# EAGLE design Adafruit HUZZAH ESP8266 Basic Breakout (EAGLE 8.6.0)
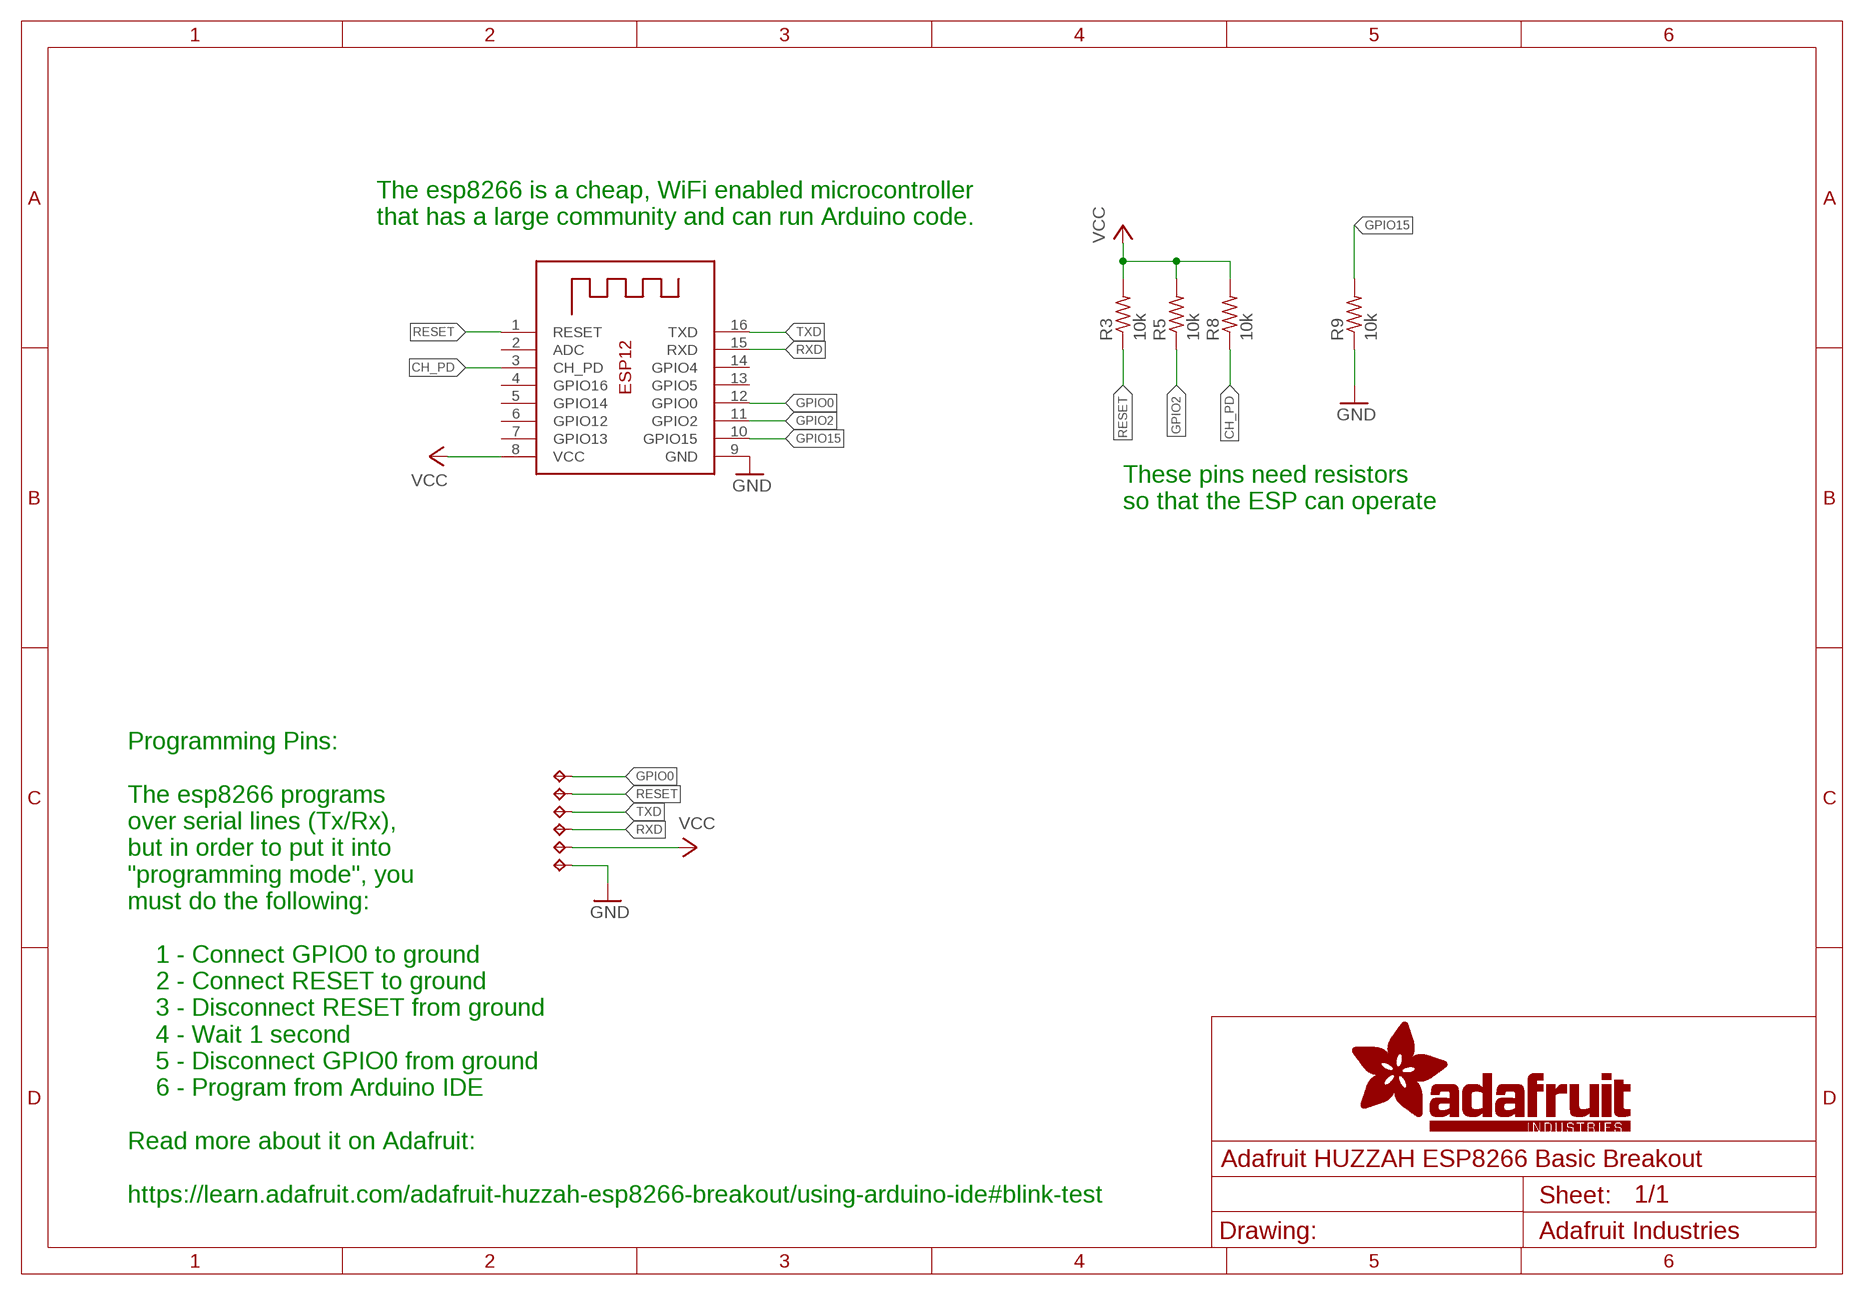
[diagram p0: schematic, sheet 1]

## Parts
GND  TPTP20R  [TP20R]
GPIO0  TPTP20R  [TP20R]
R3  10k  R-US_R0603  [R0603]
R5  10k  R-US_R0603  [R0603]
R8  10k  R-US_R0603  [R0603]
R9  10k  R-US_R0603  [R0603]
RESET  TPTP20R  [TP20R]
RX  TPTP20R  [TP20R]
TX  TPTP20R  [TP20R]
VCC  TPTP20R  [TP20R]
X1  ESP-12  [ESP-12]

## Nets
CH_PD: R8.1 X1.3(CH_PD)
GND: GND.TP R9.1 X1.9(GND)
GPIO0: GPIO0.TP X1.12(GPIO0)
GPIO2: R5.1 X1.11(GPIO2)
GPIO15: R9.2 X1.10(GPIO15)
RESET: R3.1 RESET.TP X1.1(RESET)
RXD: RX.TP X1.15(RXD)
TXD: TX.TP X1.16(TXD)
VCC: R3.2 R5.2 R8.2 VCC.TP X1.8(VCC)
Unconnected: X1.2(ADC) X1.4(GPIO16) X1.5(GPIO14) X1.6(GPIO12) X1.7(GPIO13) X1.13(GPIO5) X1.14(GPIO4)

## Notes on the sheet
- The esp8266 is a cheap, WiFi enabled microcontroller
  that has a large community and can run Arduino code.
- These pins need resistors
  so that the ESP can operate
- Programming Pins:
  
  The esp8266 programs
  over serial lines (Tx/Rx),
  but in order to put it into
  "programming mode", you
  must do the following:
  
      1 - Connect GPIO0 to ground
      2 - Connect RESET to ground
      3 - Disconnect RESET from ground
      4 - Wait 1 second
      5 - Disconnect GPIO0 from ground
      6 - Program from Arduino IDE
  
  Read more about it on Adafruit:
  
  https://learn.adafruit.com/adafruit-huzzah-esp8266-breakout/using-arduino-ide#blink-test

## Library data of the parts
GND GPIO0 RESET RX TX VCC = testpad:TP: Test pad
R3 R5 R8 R9 = rcl:R-US_: RESISTOR, American symbol; SPICEPREFIX: R
X1 = microbuilder:ESP-12

## Board
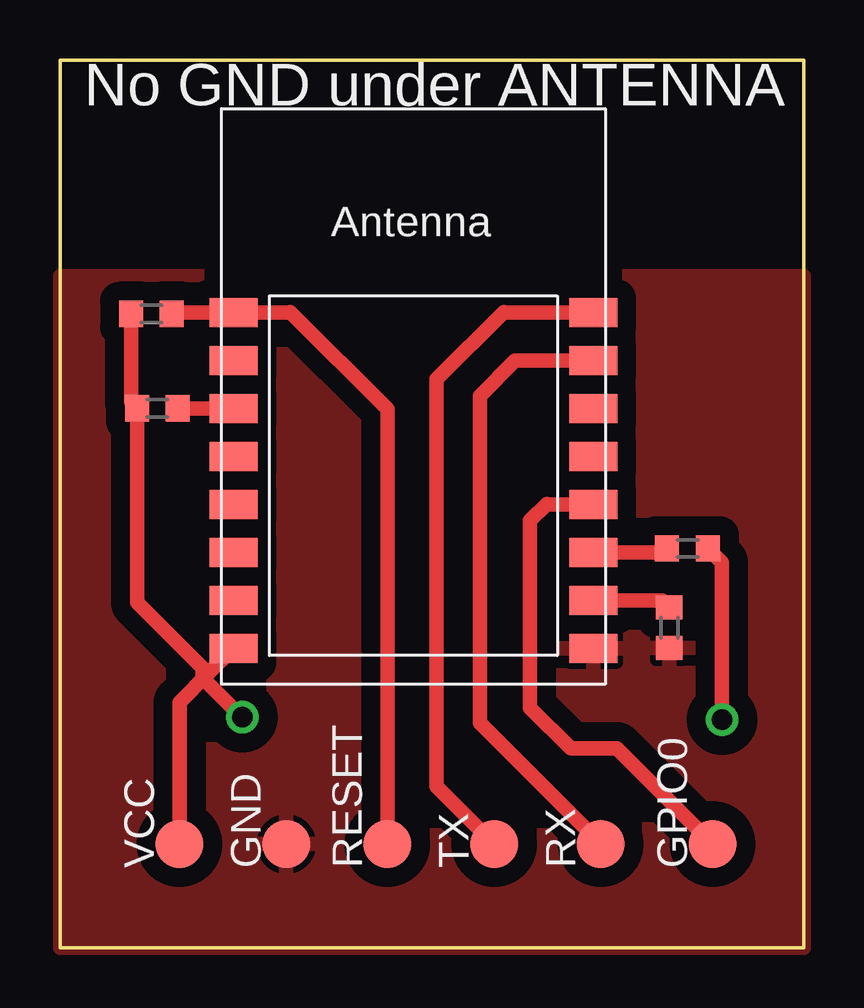
[diagram p1: board, top side]
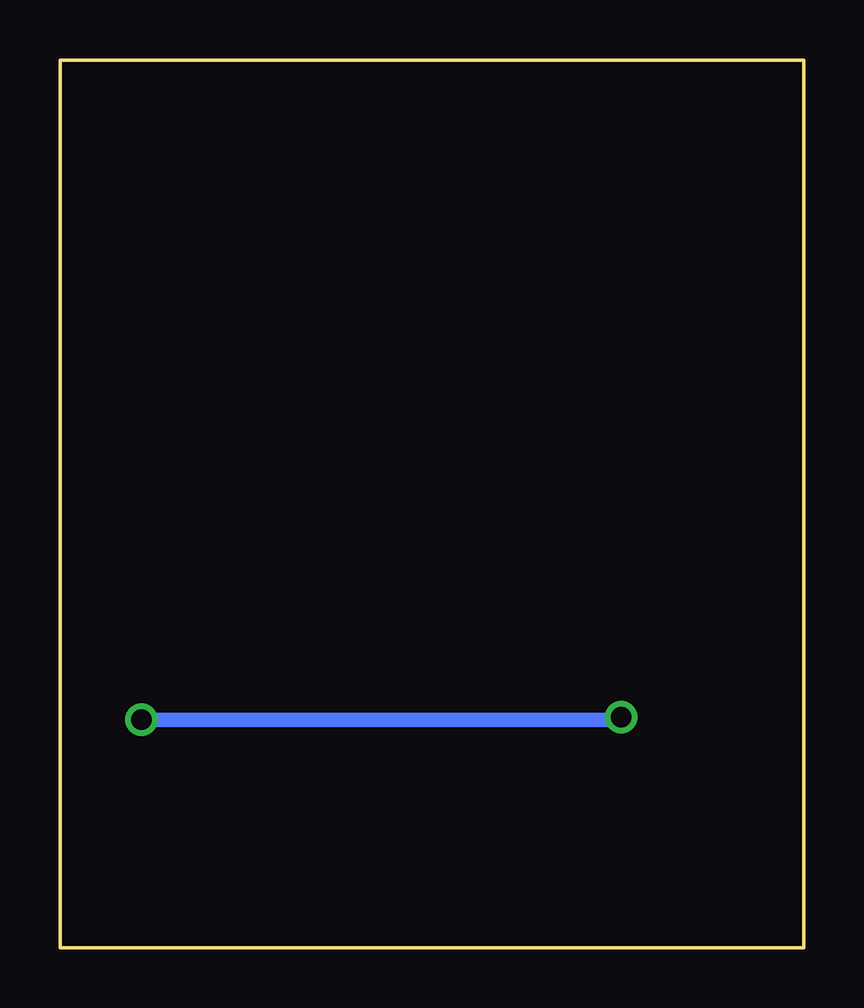
[diagram p2: board, bottom side, seen from below]

Size 31 x 37 mm. Coordinates in mm from the lower left corner, seen from the top.
Outline: 0,0 0,37 31,37 31,0 0,0
Copper layers (1*16): Top 0.035mm / dielectric 1.5mm / Bottom 0.035mm
Design rules "OthermillDRC_1_32_v2": minimum track width 8mil, minimum drill 0.8mm, track to track 0.794003125mm, track to pad 0.794003125mm, pad to pad 0.794003125mm, via to via 0.794003125mm, smd to smd 0mil, copper to edge 0mil, drill to drill 1mil, minimum pad ring 10mil, minimum via ring 10mil, stop-mask expansion 1mil, vias tented up to drill 30mil, thermal gap 10mil

### Footprints (pad centres in the part's own frame; a part is rotated, then mirrored left to right if it is on the bottom)
TP20R = smd 2 x 2: TP 0,0
R0603 = smd 1 x 1.1: 1 -0.85,0; 2 0.85,0
ESP-12 = smd 2 x 1.2: 1 -7.5,4.5; 2 -7.5,2.5; 3 -7.5,0.5; 4 -7.5,-1.5; 5 -7.5,-3.5; 6 -7.5,-5.5; 7 -7.5,-7.5; 8 -7.5,-9.5; 9 7.5,-9.5; 10 7.5,-7.5; 11 7.5,-5.5; 12 7.5,-3.5; 13 7.5,-1.5; 14 7.5,0.5; 15 7.5,2.5; 16 7.5,4.5

### Placement (x,y rotation side)
GND  9.43,4.32 90 top
GPIO0  27.21,4.32 90 top
R3  3.81,26.42 180 top
R5  26.16,16.64 0 top
R8  4.06,22.48 180 top
R9  25.4,13.34 90 top
RESET  13.65,4.32 90 top
RX  22.54,4.32 90 top
TX  18.1,4.32 90 top
VCC  4.99,4.32 90 top
X1  14.73,21.97 0 top

### Tracks (layer width: path | path; a pad name or v marks a point on that pad's centre or on a via)
CH_PD
  Top 0.61: X1.3 4.92,22.47 R8.1
GND
  pour Top: 0,28 31,28 31,0 0,0
GPIO0
  Top 0.61: GPIO0.TP 23.23,8.3 21.3,8.3 19.6,10 19.6,17.8 20.3,18.5 20.33,18.47 X1.12
GPIO2
  Top 0.61: X1.11 25.15,16.47 R5.1
GPIO15
  Top 0.61: X1.10 25.11,14.47 R9.2
RESET
  Top 0.61: R3.1 4.71,26.47 X1.1 9.57,26.47 9.6,26.5 13.65,22.45 RESET.TP
RXD
  Top 0.61: X1.15 18.97,24.47 17.5,23 17.5,9.36 RX.TP
TXD
  Top 0.61: TX.TP 15.7,6.71 15.7,23.7 18.5,26.5 18.53,26.47 X1.16
VCC  (via drill 0.85)
  Top 0.61: VCC.TP 4.99,10.23 6.18,11.42 | 6.18,11.42 X1.8 | R3.2 2.96,22.73 R8.2 3.21,14.39 5.95,11.65 | 5.95,11.65 6.18,11.42 | R5.2 27.6,16.05 v27.6,9.5 | v7.6,9.6 5.95,11.25 5.95,11.65
  Bottom 0.61: v27.6,9.5 7.7,9.5 v7.6,9.6

### Text on the board
tPlace: No GND under ANTENNA